# Altium schematic sheet Enconder_Part3.SchDoc
size A4
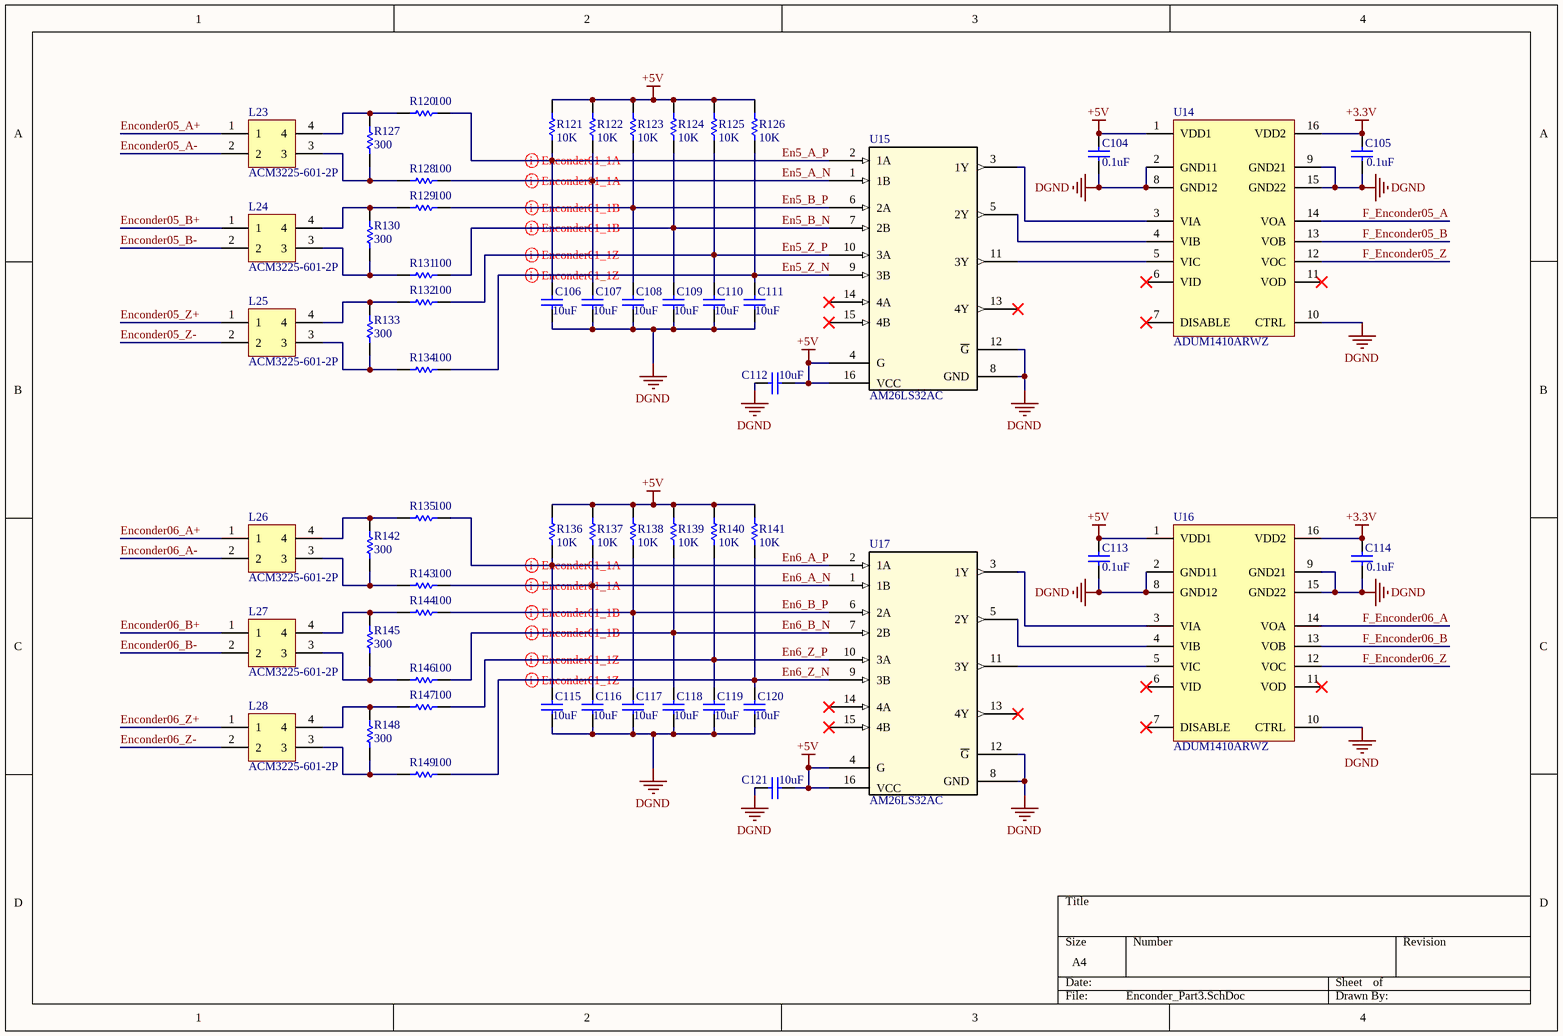
[diagram p0: Enconder_Part3.SchDoc]

## Parts
C104  value 0.1uF  [1608[0603]]  (hidden comment: Cap)
C105  value 0.1uF  [1608[0603]]  (hidden comment: Cap)
C106  value 10uF  [1608[0603]]  (hidden comment: Cap)
C107  value 10uF  [1608[0603]]  (hidden comment: Cap)
C108  value 10uF  [1608[0603]]  (hidden comment: Cap)
C109  value 10uF  [1608[0603]]  (hidden comment: Cap)
C110  value 10uF  [1608[0603]]  (hidden comment: Cap)
C111  value 10uF  [1608[0603]]  (hidden comment: Cap)
C112  value 10uF  [1608[0603]]  (hidden comment: Cap)
C113  value 0.1uF  [1608[0603]]  (hidden comment: Cap)
C114  value 0.1uF  [1608[0603]]  (hidden comment: Cap)
C115  value 10uF  [1608[0603]]  (hidden comment: Cap)
C116  value 10uF  [1608[0603]]  (hidden comment: Cap)
C117  value 10uF  [1608[0603]]  (hidden comment: Cap)
C118  value 10uF  [1608[0603]]  (hidden comment: Cap)
C119  value 10uF  [1608[0603]]  (hidden comment: Cap)
C120  value 10uF  [1608[0603]]  (hidden comment: Cap)
C121  value 10uF  [1608[0603]]  (hidden comment: Cap)
L23  ACM3225-601-2P  [ACM3225-601-2P]
L24  ACM3225-601-2P  [ACM3225-601-2P]
L25  ACM3225-601-2P  [ACM3225-601-2P]
L26  ACM3225-601-2P  [ACM3225-601-2P]
L27  ACM3225-601-2P  [ACM3225-601-2P]
L28  ACM3225-601-2P  [ACM3225-601-2P]
R120  value 100  [1608[0603]]  (hidden comment: Res1)
R121  value 10K  [1608[0603]]  (hidden comment: Res1)
R122  value 10K  [1608[0603]]  (hidden comment: Res1)
R123  value 10K  [1608[0603]]  (hidden comment: Res1)
R124  value 10K  [1608[0603]]  (hidden comment: Res1)
R125  value 10K  [1608[0603]]  (hidden comment: Res1)
R126  value 10K  [1608[0603]]  (hidden comment: Res1)
R127  value 300  [1608[0603]]  (hidden comment: Res1)
R128  value 100  [1608[0603]]  (hidden comment: Res1)
R129  value 100  [1608[0603]]  (hidden comment: Res1)
R130  value 300  [1608[0603]]  (hidden comment: Res1)
R131  value 100  [1608[0603]]  (hidden comment: Res1)
R132  value 100  [1608[0603]]  (hidden comment: Res1)
R133  value 300  [1608[0603]]  (hidden comment: Res1)
R134  value 100  [1608[0603]]  (hidden comment: Res1)
R135  value 100  [1608[0603]]  (hidden comment: Res1)
R136  value 10K  [1608[0603]]  (hidden comment: Res1)
R137  value 10K  [1608[0603]]  (hidden comment: Res1)
R138  value 10K  [1608[0603]]  (hidden comment: Res1)
R139  value 10K  [1608[0603]]  (hidden comment: Res1)
R140  value 10K  [1608[0603]]  (hidden comment: Res1)
R141  value 10K  [1608[0603]]  (hidden comment: Res1)
R142  value 300  [1608[0603]]  (hidden comment: Res1)
R143  value 100  [1608[0603]]  (hidden comment: Res1)
R144  value 100  [1608[0603]]  (hidden comment: Res1)
R145  value 300  [1608[0603]]  (hidden comment: Res1)
R146  value 100  [1608[0603]]  (hidden comment: Res1)
R147  value 100  [1608[0603]]  (hidden comment: Res1)
R148  value 300  [1608[0603]]  (hidden comment: Res1)
R149  value 100  [1608[0603]]  (hidden comment: Res1)
U14  ADUM1410ARWZ  [ADUM1410ARWZ_SOIC]
U15  AM26LS32AC  [AM26LS32AC_SOP]
U16  ADUM1410ARWZ  [ADUM1410ARWZ_SOIC]
U17  AM26LS32AC  [AM26LS32AC_SOP]

## Nets
+3.3V: C105.2 C114.2 U14.16(VDD2) U16.16(VDD2)
+5V: C104.2 C112.1 C113.2 C121.1 R121.2 R122.2 R123.2 R124.2 R125.2 R126.2 R136.2 R137.2 R138.2 R139.2 R140.2 R141.2 U14.1(VDD1) U15.4(G) U15.16(VCC) U16.1(VDD1) U17.4(G) U17.16(VCC)
DGND: C104.1 C105.1 C106.1 C107.1 C108.1 C109.1 C110.1 C111.1 C112.2 C113.1 C114.1 C115.1 C116.1 C117.1 C118.1 C119.1 C120.1 C121.2 U14.2(GND11) U14.8(GND12) U14.9(GND21) U14.10(CTRL) U14.15(GND22) U15.8(GND) U15.12(~{G}) U16.2(GND11) U16.8(GND12) U16.9(GND21) U16.10(CTRL) U16.15(GND22) U17.8(GND) U17.12(~{G})
En5_A_N: C107.2 R122.1 R128.2 U15.1(1B)
En5_A_P: C106.2 R120.2 R121.1 U15.2(1A)
En5_B_N: C109.2 R124.1 R131.2 U15.7(2B)
En5_B_P: C108.2 R123.1 R129.2 U15.6(2A)
En5_Z_N: C111.2 R126.1 R134.2 U15.9(3B)
En5_Z_P: C110.2 R125.1 R132.2 U15.10(3A)
En6_A_N: C116.2 R137.1 R143.2 U17.1(1B)
En6_A_P: C115.2 R135.2 R136.1 U17.2(1A)
En6_B_N: C118.2 R139.1 R146.2 U17.7(2B)
En6_B_P: C117.2 R138.1 R144.2 U17.6(2A)
En6_Z_N: C120.2 R141.1 R149.2 U17.9(3B)
En6_Z_P: C119.2 R140.1 R147.2 U17.10(3A)
Enconder05_A+: L23.1
Enconder05_A-: L23.2
Enconder05_B+: L24.1
Enconder05_B-: L24.2
Enconder05_Z+: L25.1
Enconder05_Z-: L25.2
Enconder06_A+: L26.1
Enconder06_A-: L26.2
Enconder06_B+: L27.1
Enconder06_B-: L27.2
Enconder06_Z+: L28.1
Enconder06_Z-: L28.2
F_Enconder05_A: U14.14(VOA)
F_Enconder05_B: U14.13(VOB)
F_Enconder05_Z: U14.12(VOC)
F_Enconder06_A: U16.14(VOA)
F_Enconder06_B: U16.13(VOB)
F_Enconder06_Z: U16.12(VOC)
NetL23_3: L23.3 R127.1 R128.1
NetL23_4: L23.4 R120.1 R127.2
NetL24_3: L24.3 R130.1 R131.1
NetL24_4: L24.4 R129.1 R130.2
NetL25_3: L25.3 R133.1 R134.1
NetL25_4: L25.4 R132.1 R133.2
NetL26_3: L26.3 R142.1 R143.1
NetL26_4: L26.4 R135.1 R142.2
NetL27_3: L27.3 R145.1 R146.1
NetL27_4: L27.4 R144.1 R145.2
NetL28_3: L28.3 R148.1 R149.1
NetL28_4: L28.4 R147.1 R148.2
NetU14_3: U14.3(VIA) U15.3(1Y)
NetU14_4: U14.4(VIB) U15.5(2Y)
NetU14_5: U14.5(VIC) U15.11(3Y)
NetU16_3: U16.3(VIA) U17.3(1Y)
NetU16_4: U16.4(VIB) U17.5(2Y)
NetU16_5: U16.5(VIC) U17.11(3Y)

Not connected (* = marked no-connect by the designer): U14 6(VID)* 7(DISABLE)* 11(VOD)*; U15 13(4Y)* 14(4A)* 15(4B)*; U16 6(VID)* 7(DISABLE)* 11(VOD)*; U17 13(4Y)* 14(4A)* 15(4B)*

## Layout directives
differential pair: En5_A_N, En5_A_P, En5_B_N, En5_B_P, En5_Z_N, En5_Z_P, En6_A_N, En6_A_P, En6_B_N, En6_B_P, En6_Z_N, En6_Z_P

## Library data of the parts
C104-C121 = Cap: Capacitor; Published: 8-Jun-2000; LatestRevisionDate: 17-Jul-2002; LatestRevisionNote: Re-released for DXP Platform.; PackageReference: RAD-0.3; Publisher: Altium Limited; PackageDescription: Radial Cap, Thru-Hole; 2 Leads; 0.3 in Pin Spacing
R120-R149 = Res1: Resistor; Published: 8-Jun-2000; LatestRevisionDate: 17-Jul-2002; LatestRevisionNote: Re-released for DXP Platform.; PackageReference: AXIAL-0.3; Publisher: Altium Limited; PackageDescription: Axial Device, Thru-Hole; 2 Leads; 0.3 in Pin Spacing